# EAGLE design Wiper Control v2 (EAGLE 9.6.1)
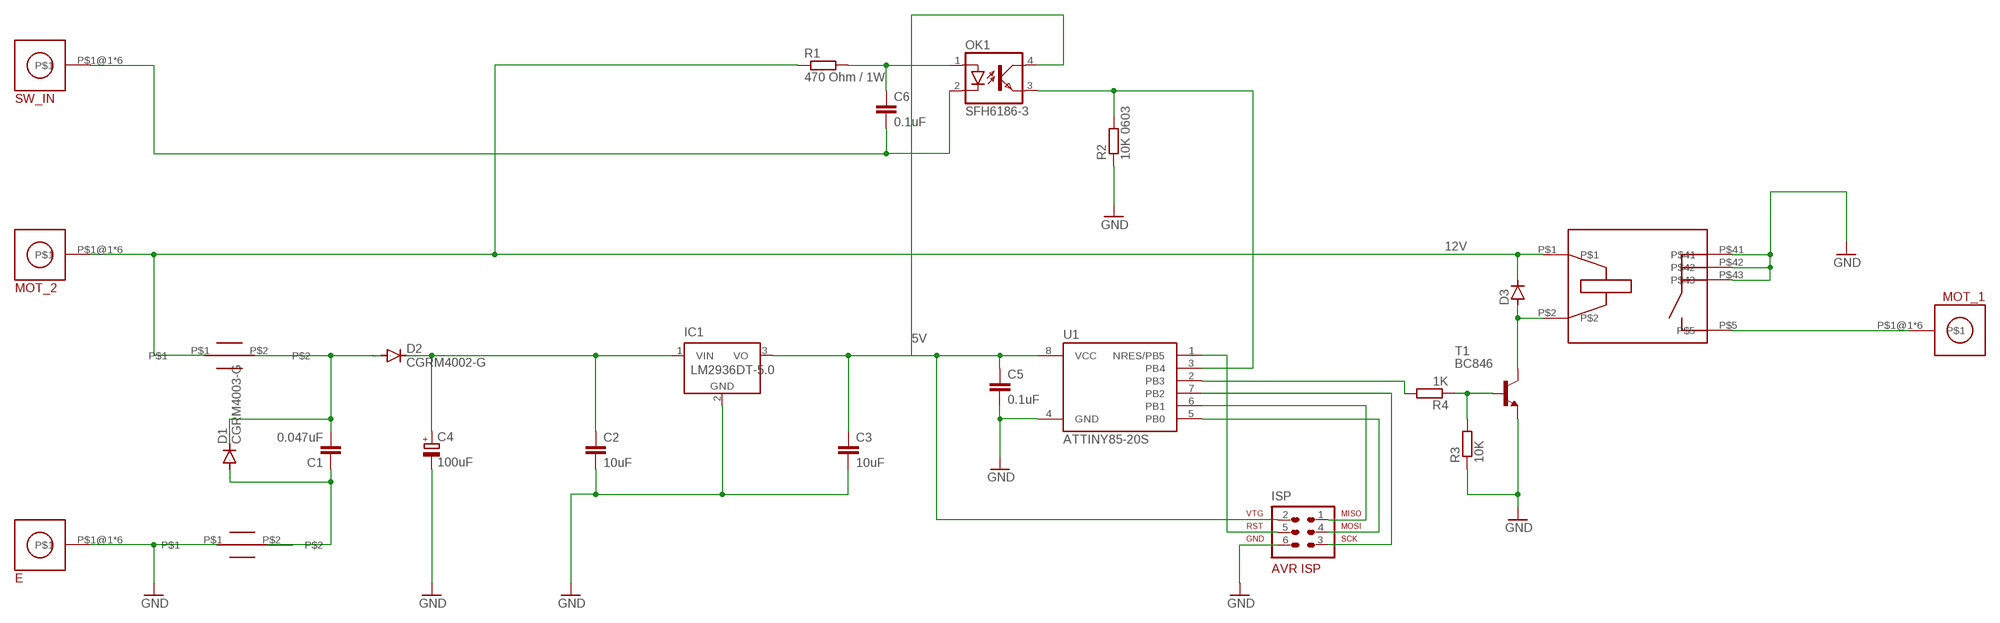
[diagram p0: schematic, sheet 1]

## Parts
B1  FBMJ2125  [FBMJ]
B2  FBMJ2125  [FBMJ]
C1  0.047uF  C-EUC0603  [C0603]
C2  10uF  C-EUC0805  [C0805]
C3  10uF  C-EUC0805  [C0805]
C4  100uF  CPOL-EUE2.5-7  [E2,5-7]
C5  0.1uF  C-EUC0603  [C0603]
C6  0.1uF  C-EUC0603  [C0603]
D1  CGRM4003-G  [SOD-123_MINI-SMA]
D2  CGRM4002-G  [SOD-123_MINI-SMA]
D3  D-SOD123  [SOD123]
E  M4_SCREW_TERMINAL  [M4_SCREW_TERMINAL]
IC1  LM2936DT-5.0  [TO252]
ISP  AVR-ISP-6  [AVR-ISP-6]
MOT_1  M4_SCREW_TERMINAL  [M4_SCREW_TERMINAL]
MOT_2  M4_SCREW_TERMINAL  [M4_SCREW_TERMINAL]
OK1  SFH6186-3  [SMD4-7]
R1  470 Ohm / 1W  R-EU_R2512  [R2512]
R2  10K 0603  R-EU_R0603  [R0603]
R3  10K  R-EU_R0603  [R0603]
R4  1K  R-EU_R0603  [R0603]
SW_IN  M4_SCREW_TERMINAL  [M4_SCREW_TERMINAL]
T1  BC846  [SOT23]
U1  ATTINY85-20S  [SOIC8_EIAJ_208MIL]
U$3  RELAY  [RELAY]

## Nets
5V: C3.1 C5.1 IC1.3(VO) ISP.2 OK1.4(COL) U1.8(VCC)
12V: B1.P$1 D3.1(C) MOT_2.P$1@1 MOT_2.P$1@2 MOT_2.P$1@3 MOT_2.P$1@4 MOT_2.P$1@5 MOT_2.P$1@6 R1.1 U$3.P$1
GND: B2.P$1 C2.2 C3.2 C4.- C5.2 E.P$1@1 E.P$1@2 E.P$1@3 E.P$1@4 E.P$1@5 E.P$1@6 IC1.2(GND) ISP.6 R2.1 R3.1 T1.2(E) U1.4(GND) U$3.P$41 U$3.P$42 U$3.P$43
N$1: B1.P$2 C1.2 D1.C D2.A
N$2: B2.P$2 C1.1 D1.A
N$3: C2.1 C4.+ D2.C IC1.1(VIN)
N$4: ISP.1 U1.6(PB1)
N$5: ISP.4 U1.5(PB0)
N$6: ISP.3 U1.7(PB2)
N$7: ISP.5 U1.1(NRES/PB5)
N$8: D3.2(A) T1.3(C) U$3.P$2
N$9: R3.2 R4.1 T1.1(B)
N$10: MOT_1.P$1@1 MOT_1.P$1@2 MOT_1.P$1@3 MOT_1.P$1@4 MOT_1.P$1@5 MOT_1.P$1@6 U$3.P$5
N$11: C6.1 OK1.1(A) R1.2
N$13: OK1.3(EMIT) R2.2 U1.3(PB4)
N$14: R4.2 U1.2(PB3)
N$20: C6.2 OK1.2(C) SW_IN.P$1@1 SW_IN.P$1@2 SW_IN.P$1@3 SW_IN.P$1@4 SW_IN.P$1@5 SW_IN.P$1@6

## Library data of the parts
B1 B2 = Automotive 12V5V Converter:FBMJ2125
C1-C3 C5 C6 = rcl:C-EU: CAPACITOR, European symbol; SPICEPREFIX: C
C4 = rcl:CPOL-EU: POLARIZED CAPACITOR, European symbol; SPICEPREFIX: C
D1 D2 = diode:CGRM400*-G: Molded plasitc,JEDEC SOD-123/Mini SMA Source: Comchip CGRM4001-G.pdf
D3 = semicon-smd-ipc:D-: DIODE unfilled
E MOT_1 MOT_2 SW_IN = Automotive 12V5V Converter:M4_SCREW_TERMINAL
IC1 = national-semiconductor:LM2936?*: Ultra-Low Quiescent Current LDO Voltage Regulator Source: Data sheet <http://www.national.com/ds/LM/LM2936.pdf>; MF: NATIONAL SEMICONDUCTOR; MPN: LM2936DT-5.0/NOPB; OC_FARNELL: 1286864; OC_NEWARK: 41K4501
ISP = atmel:AVR-ISP-6: AVR ISP-6 Serial Programming Header
OK1 = optocoupler:SFH618?*: Optocoupler, Phototransistor Output, Low Input Current Source: Data sheet <http://www.vishay.com/docs/83673/sfh618.pdf>; MF: VISHAY/TELEFUNKEN; MPN: SFH6186-3; OC_FARNELL: 1469529; OC_NEWARK: 21H7751
R1-R4 = rcl:R-EU_: RESISTOR, European symbol; SPICEPREFIX: R
T1 = transistor-neu-to92:BC846: NPN TRANSISTOR
U1 = _hhn_attiny25_45_85:ATTINY85*: ATMEL ATtiny 85 Packages: P = PDIP 08 30mil S = SOIC 08 EIAJ 208mil Technologies Note: for complete ordering code (temp. range, finish, tape&reel etc.) see www.atmel.com • Supply Voltage: V = (1.8…5.5)V | [blank] = (2.7…5.5)V • Speed: 10 = 10 MHz | 20 = 20 MHz Author: Dipl.-Ing. FH Rainer Bayer HHN Hochschule Heilbronn (Heilbronn University), rainer.bayer@hs-heilbronn.de Ingenieurbüro ing-rb, mail@ing-rb.de
U$3 = Automotive 12V5V Converter:RELAY

## Board
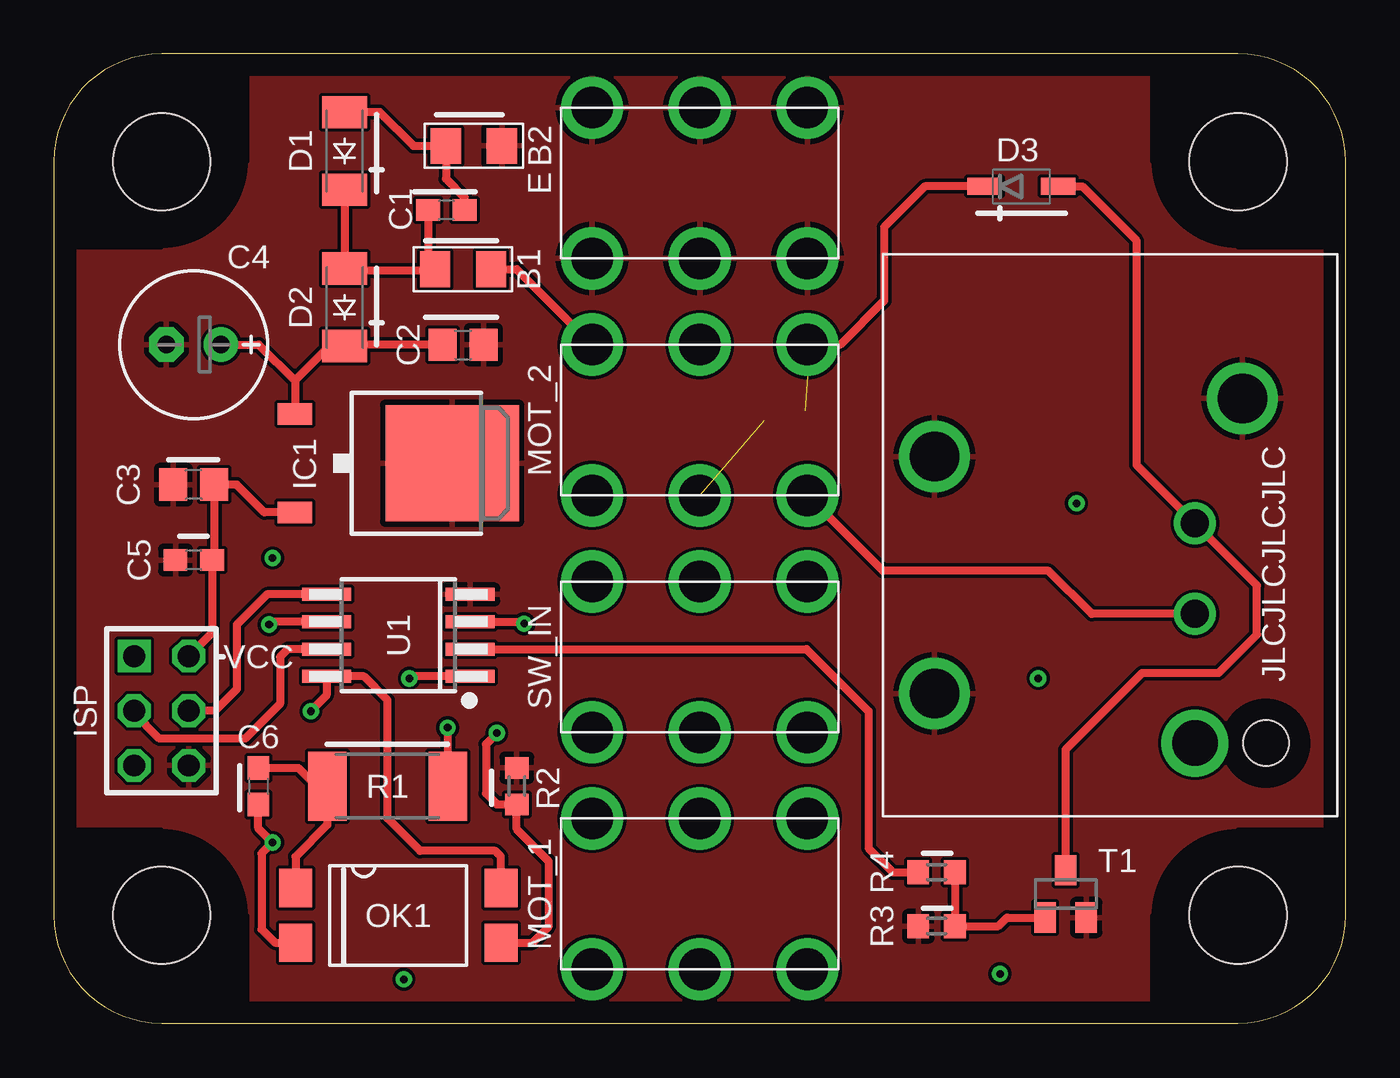
[diagram p1: board, top side]
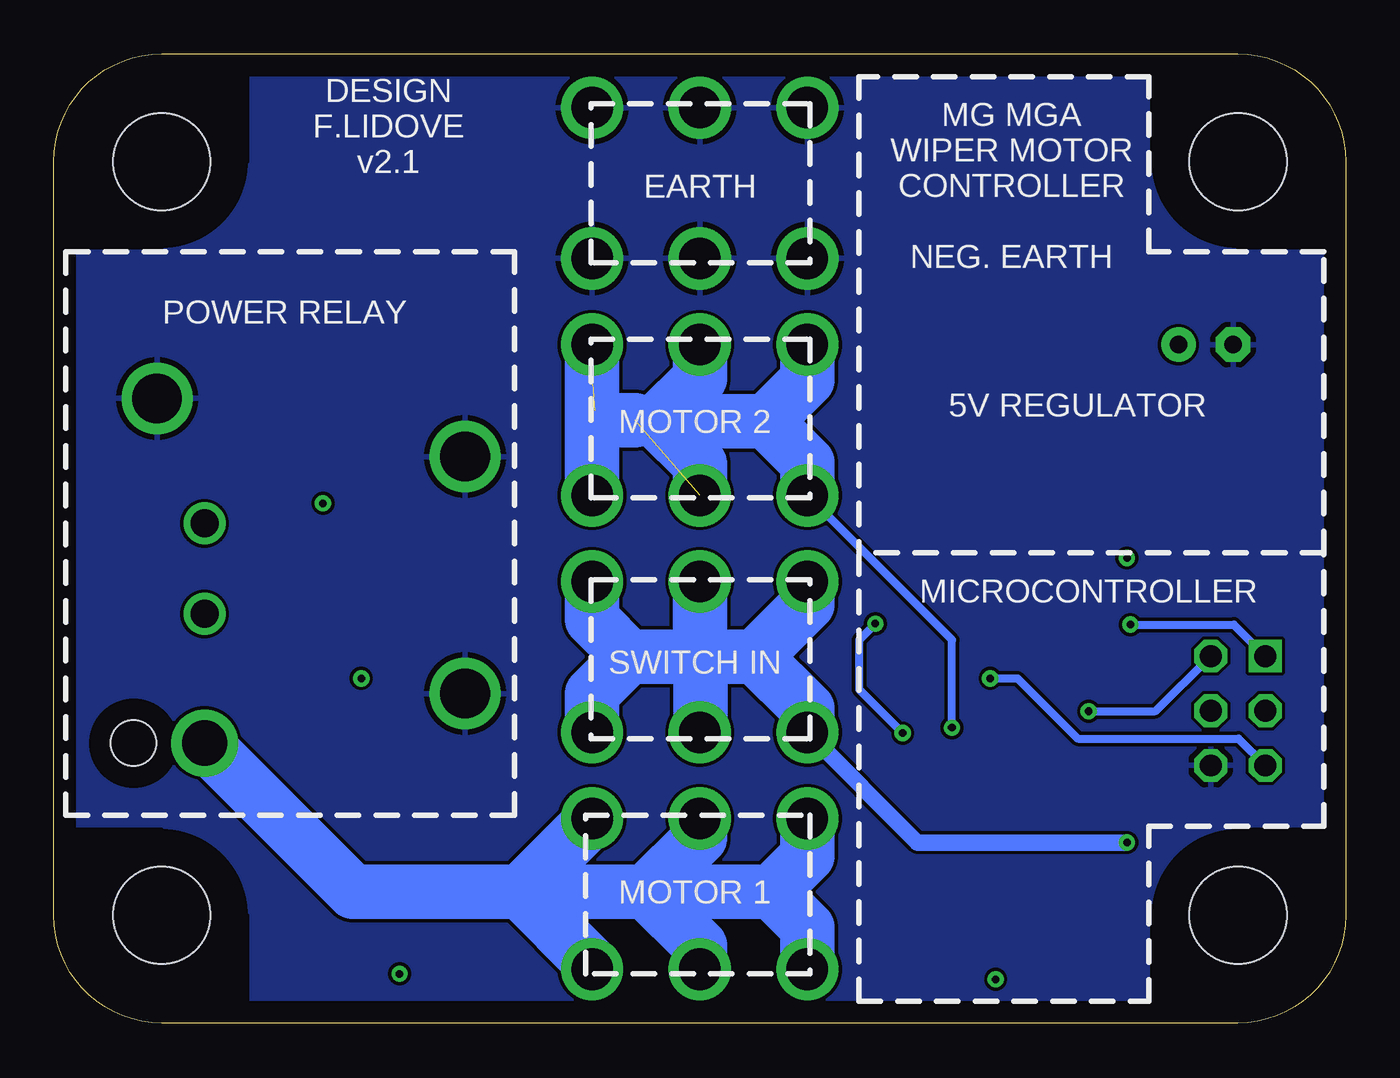
[diagram p2: board, bottom side, seen from below]

Size 60 x 45 mm. Coordinates in mm from the lower left corner, seen from the top.
Outline: 0,40 0,5 arc90 5,0 55,0 arc90 60,5 60,40 arc90 55,45 5,45 arc90 0,40
Copper layers (1*16): Top 0.035mm / dielectric 1.5mm / Bottom 0.035mm
Design rules "default": minimum track width 6mil, minimum drill 0.35mm, track to track 6mil, track to pad 6mil, pad to pad 6mil, via to via 6mil, smd to smd 6mil, copper to edge 40mil, drill to drill 6mil, minimum pad ring 10mil, minimum via ring 8mil, stop-mask expansion 4mil, vias tented up to drill 0mil, thermal gap 10mil
Holes 4.5 mm at 5,40 5,5 55,40 55,5
tKeepout: area 1,36 to 9,44; area 1,1 to 9,9; area 51,1 to 59,9
tRestrict: area 51,36 to 59,44; area 1,36 to 9,44; area 1,1 to 9,9; area 51,1 to 59,9
bRestrict: area 51,36 to 59,44; area 1,36 to 9,44; area 1,1 to 9,9; area 51,1 to 59,9

### Footprints (pad centres in the part's own frame; a part is rotated, then mirrored left to right if it is on the bottom)
FBMJ = smd 1.4 x 1.65: P$1 -1.3,0; P$2 1.3,0
C0603 = smd 1.1 x 1: 1 -0.85,0; 2 0.85,0
C0805 = smd 1.3 x 1.5: 1 -0.95,0; 2 0.95,0
E2,5-7 = drill 0.813 pad 1.6: + -1.27,0 | drill 0.813 pad 1.6 octagon: - 1.27,0
SOD-123_MINI-SMA = smd 1.5 x 2.1: A 1.8,0; C -1.8,0
SOD123 = smd 1.6 x 0.8: 1 -1.7,0; 2 1.7,0
M4_SCREW_TERMINAL = drill 1.93: P$1@1 0,0; P$1@2 5,0; P$1@3 10,0; P$1@4 0,7; P$1@5 5,7; P$1@6 10,7
TO252 = smd 1 x 1.6: 1 -2.28,-4.8; 3 2.28,-4.8 | smd 5.4 x 6.2: 2 0,2.5
AVR-ISP-6 = drill 1.016 square: 1 -2.54,-1.27 | drill 1.016 octagon: 2 -2.54,1.27; 3 0,-1.27; 4 0,1.27; 5 2.54,-1.27; 6 2.54,1.27
SMD4-7 = smd 1.78 x 1.55: 1 -1.27,-4.77; 2 1.27,-4.77; 3 1.27,4.77; 4 -1.27,4.77
R2512 = smd 1.8 x 3.2: 1 -2.8,0; 2 2.8,0
R0603 = smd 1 x 1.1: 1 -0.85,0; 2 0.85,0
SOT23 = smd 1 x 1.4: 1 -0.95,-1.1; 2 0.95,-1.1; 3 0,1.1
SOIC8_EIAJ_208MIL = smd 0.6 x 2.286: 1 -1.905,-3.33; 2 -0.635,-3.33; 3 0.635,-3.33; 4 1.905,-3.33; 5 1.905,3.33; 6 0.635,3.33; 7 -0.635,3.33; 8 -1.905,3.33
RELAY = drill 1.3: P$1 6,0; P$2 10.2,0 | drill 2.1: P$5 0,0 | drill 2.3: P$41 2.3,-12.1; P$42 13.3,-12.1; P$43 16,2.2 | hole 2.1: 0,3.3

### Placement (x,y rotation side)
B1  19,35 180 top
B2  19.51,40.73 180 top
C1  18.23,37.75 180 top
C2  19,31.49 0 top
C3  6.5,25 180 top
C4  6.5,31.5 180 top
C5  6.5,21.5 180 top
C6  9.5,11 270 top
D1  13.5,40.49 90 top
D2  13.5,33.23 90 top
D3  44.94,38.85 0 top
E  25,35.5 0 top
IC1  16,25.99 270 top
ISP  5,14.5 270 top
MOT_1  25,2.5 0 top
MOT_2  25,24.5 0 top
OK1  16,5 270 top
R1  15.5,11 180 top
R2  21.5,11 270 top
R3  41,4.5 0 top
R4  41,7 180 top
SW_IN  25,13.5 0 top
T1  47,6 0 top
U1  16,18 90 top
U$3  53,13 90 bottom

### Tracks (layer width: path | path; a pad name or v marks a point on that pad's centre or on a via)
5V  (via drill 0.35)
  Top 0.381: IC1.3 9.78,23.71 8.49,25 C3.1 7.45,21.6 C5.1 7.35,18.12 ISP.2 | OK1.4 20.77,7.73 20.5,8 17,8 15.5,9.5 15.5,15 14.4,16.09 U1.8 12.67,15.21 v11.94,14.48
  Bottom 0.381: v11.94,14.48 8.83,14.48 ISP.2
12V  (via drill 0.35)  (2 unrouted)
  Top 0.381: B1.P$1 21.5,35 MOT_2.P$1@4 | R1.1 18.3,13.7 v18.29,13.72 | D3.1 40.45,38.85 38.56,36.96 38.56,33.53 36.52,31.5 MOT_2.P$1@6 | U$3.P$1 48.2,19 46.2,21 38.5,21 MOT_2.P$1@3
  Bottom 0.381: v18.29,13.72 18.29,17.79 MOT_2.P$1@1
  Bottom 2.54: 34.88,28.32 34.88,28.43 | 32,27.94 26.92,27.94 | 26.92,27.94 25,29.86 MOT_2.P$1@4 | MOT_2.P$1@1 25,26.02 26.92,27.94 | MOT_2.P$1@2 30,25.94 32,27.94 | MOT_2.P$1@5 30,29.94 32,27.94 | 35,30.02 MOT_2.P$1@6 35,28 | MOT_2.P$1@3 35,28 | 35,28 33,28
GND
  pour Top: 0.97,0.97 0.97,44.03 59.03,44.03 59.03,0.97
  pour Bottom: 0.97,0.97 0.97,44.03 59.03,44.03 59.03,0.97
N$1
  Top 0.381: D1.C D2.A 13.61,34.92 17.62,34.92 | 17.62,34.92 17.38,34.68 C1.2 | 17.62,34.92 B1.P$2
N$2
  Top 0.381: D1.A 15.14,42.29 16.7,40.73 B2.P$2 18.21,39.2 19.08,38.32 C1.1
N$3
  Top 0.381: C4.+ 9.52,31.5 11.2,29.82 | 11.2,29.82 11.2,29.84 12.79,31.43 D2.C 13.56,31.49 C2.1 | 11.2,29.82 IC1.1
N$4  (via drill 0.35)
  Top 0.381: U1.6 10.13,18.64 v10,18.5
  Bottom 0.381: v10,18.5 5.19,18.5 ISP.1
N$5
  Top 0.381: U1.5 9.9,19.91 8.5,18.5 8.5,15.5 7.5,14.5 ISP.4
N$6
  Top 0.381: U1.7 10.87,17.36 10.5,17 10.5,14.82 8.89,13.21 4.9,13.21 3.73,14.38 ISP.3
N$7  (via drill 0.35)
  Top 0.381: v16.51,16 16.6,16.09 U1.1
  Bottom 0.381: v16.51,16 15.24,16 12.45,13.21 4.98,13.21 ISP.5
N$8
  Top 0.381: D3.2 47.76,38.85 50.29,36.32 50.29,25.91 U$3.P$2 55.88,20.32 55.88,18.03 54.1,16.26 50.55,16.26 47,12.71 T1.3
N$9
  Top 0.381: R4.1 R3.2 43.87,4.5 44.27,4.9 T1.1
N$10
  Bottom 2.54: U$3.P$5 46.1,6.1 38.35,6.1 | 38.35,6.1 32.51,6.1 | 32.51,6.1 26.67,6.1 | 26.67,6.1 25,7.77 MOT_1.P$1@4 | MOT_1.P$1@1 25,4.43 26.67,6.1 | MOT_1.P$1@2 30,3.58 32.51,6.1 | MOT_1.P$1@5 30,8.61 32.51,6.1 | MOT_1.P$1@6 35,9.45 38.35,6.1 | MOT_1.P$1@3 35,2.74 38.35,6.1
N$11
  Top 0.381: R1.2 12.7,10.5 | 12.7,10.5 12.7,9.2 11.23,7.73 OK1.1 | C6.1 11.35,11.85 12.7,10.5
N$12
  cutout Top: 5,36 5,40 9,40 9,44 1,44 1,36
  cutout Bottom: 5,36 5,40 9,40 9,44 1,44 1,36
N$13  (via drill 0.35)
  Top 0.381: OK1.3 22.23,3.73 23,4.5 23,7.5 21.5,9 R2.2 20.58,10.15 20.07,10.67 20.07,12.95 v20.57,13.46 | U1.3 21.75,18.64 v21.84,18.54
  Bottom 0.381: v21.84,18.54 22.61,17.78 22.61,15.49 v20.57,13.46
N$14
  Top 0.381: U1.2 34.96,17.36 37.85,14.48 37.85,8.13 38.97,7 R4.2
N$15
  cutout Top: 5,5 5,9 1,9 1,1 9,1 9,5
  cutout Bottom: 5,5 5,9 1,9 1,1 9,1 9,5
  cutout Bottom: 5,5 5,9 1,9 1,1 9,1 9,5
N$16
  cutout Top: 55,5 55,9 59,9 59,1 51,1 51,5
  cutout Bottom: 55,5 55,9 59,9 59,1 51,1 51,5
N$17
  cutout Top: 55,40 51,40 51,44 59,44 59,36 55,36
  cutout Bottom: 55,40 51,40 51,44 59,44 59,36 55,36
N$18  (via drill 0.35)
  other vias: 47.5,24.13
N$19  (via drill 0.35)
  other vias: 45.72,16
N$20  (via drill 0.35)
  Top 0.381: OK1.2 10.27,3.73 9.65,4.35 9.65,7.87 v10.16,8.38 9.5,9.04 C6.2
  Bottom 0.762: v10.16,8.38 19.88,8.38 SW_IN.P$1@1
  Bottom 2.54: SW_IN.P$1@6 35,18.74 33.27,17.02 | 33.27,17.02 29.97,17.02 | 29.97,17.02 27.43,17.02 | 27.43,17.02 25,14.59 SW_IN.P$1@1 | SW_IN.P$1@4 25,19.45 27.43,17.02 | SW_IN.P$1@5 30,17.05 29.97,17.02 | SW_IN.P$1@2 29.97,13.53 29.97,17.02 | SW_IN.P$1@3 35,15.29 33.27,17.02
N$21  (via drill 0.35)
  other vias: 10.16,21.59
N$22  (via drill 0.35)
  other vias: 16.26,2.03
N$23  (via drill 0.35)
  other vias: 43.94,2.29

### Text on the board
tPlace: VCC
tNames: JLCJLCJLCJLC
bNames: DESIGN / F.LIDOVE / v2.1 | MG MGA / WIPER MOTOR / CONTROLLER / / NEG. EARTH | EARTH | POWER RELAY | 5V REGULATOR | MOTOR 2 | MICROCONTROLLER | SWITCH IN | MOTOR 1